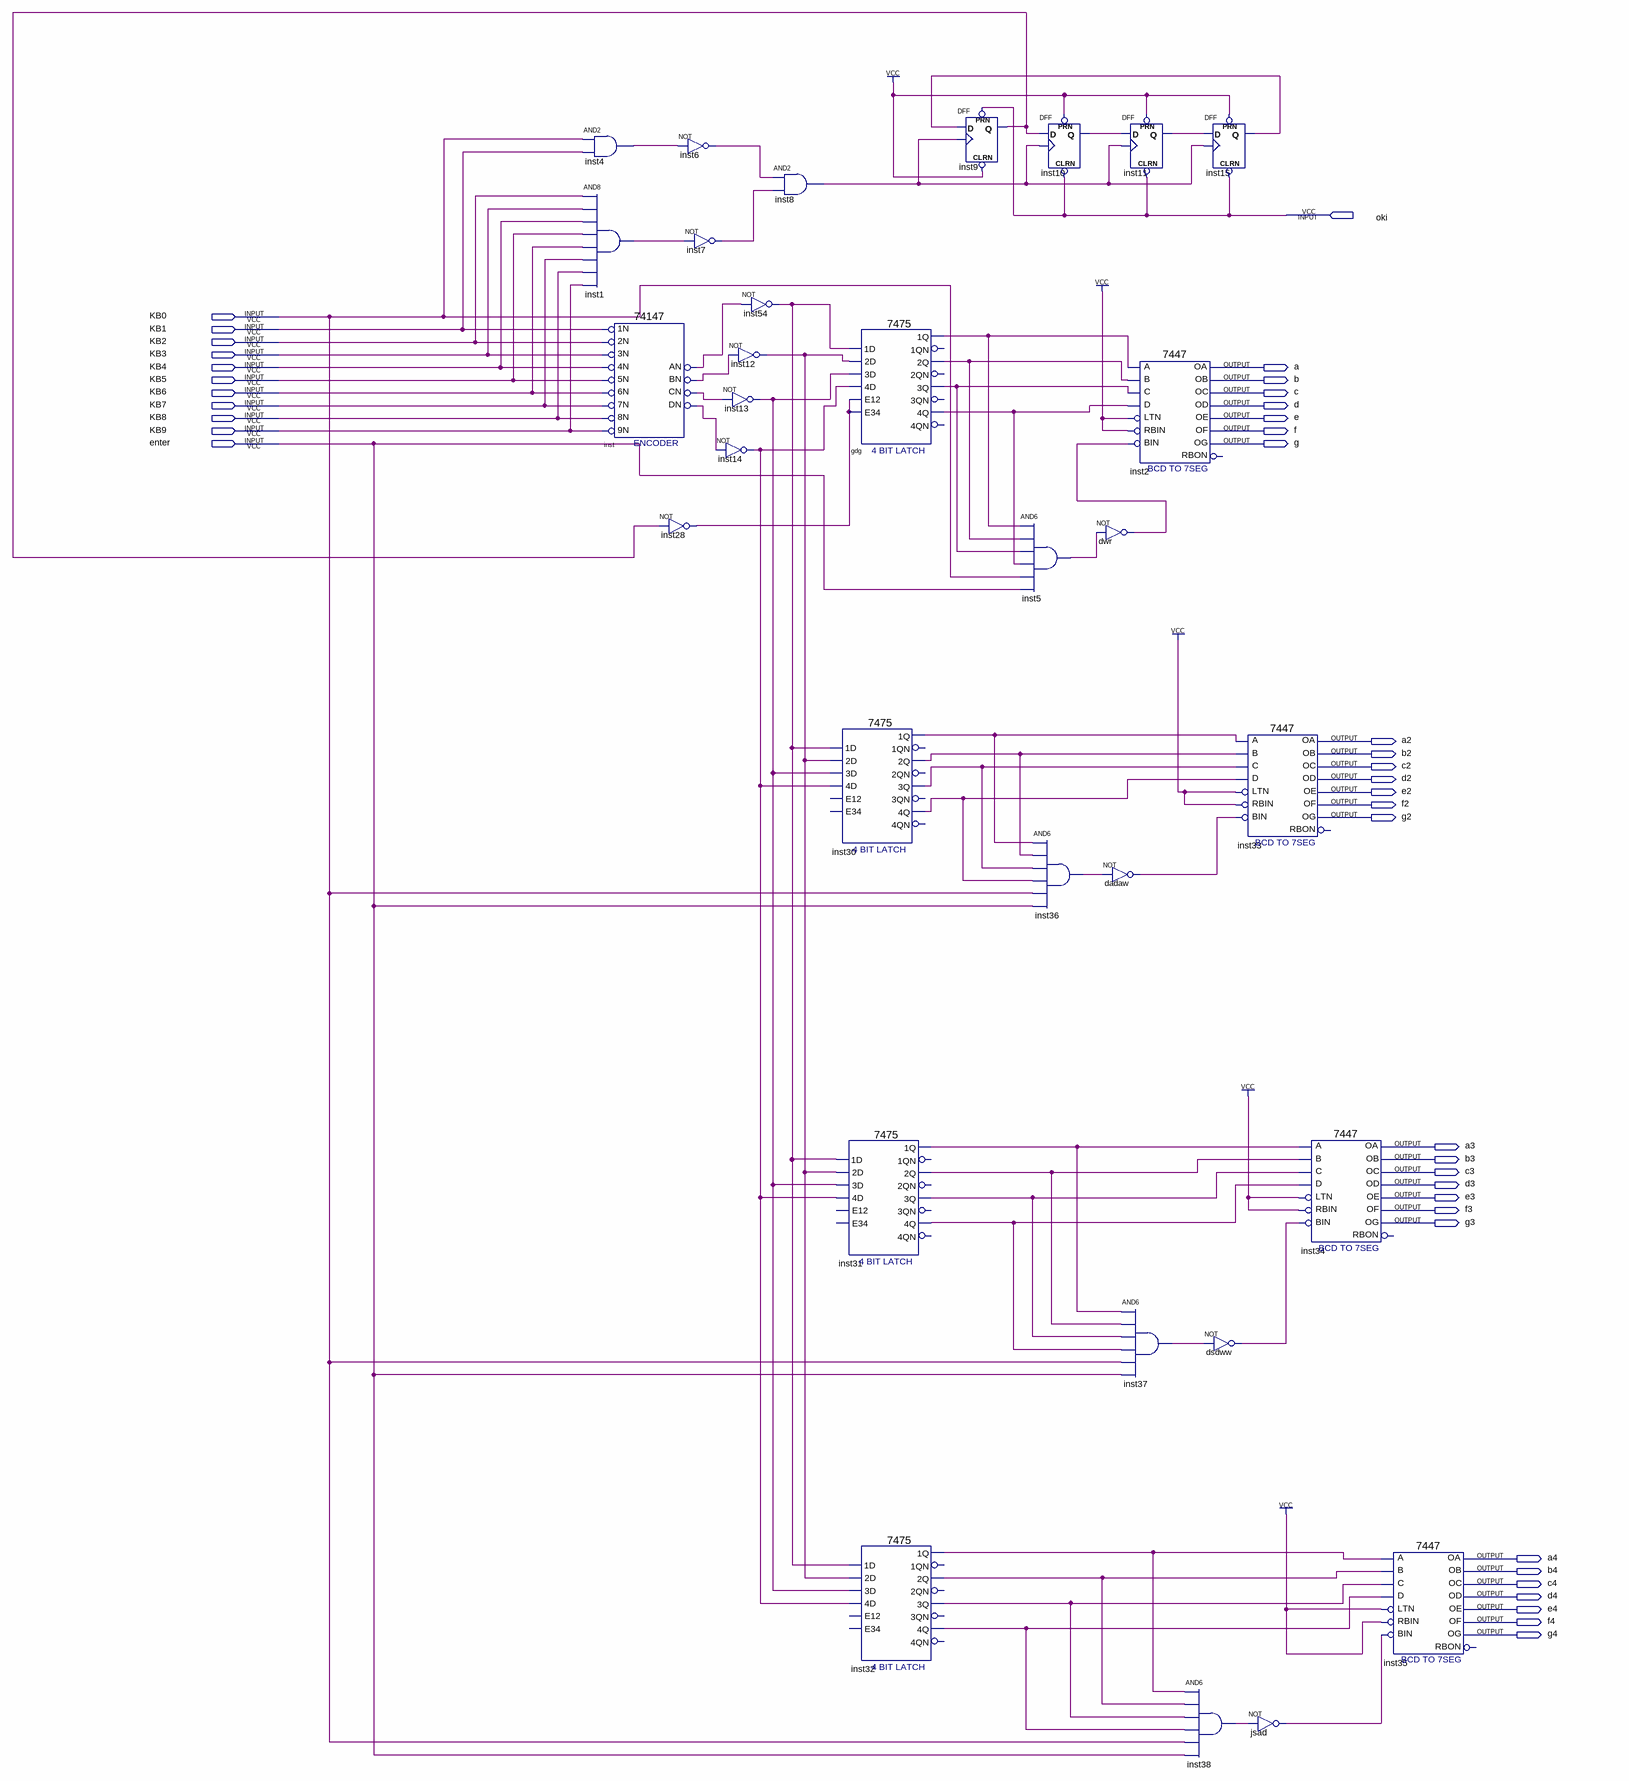
[diagram p0: schematic sheet]
// Quartus schematic SecurityBox.bdf as structural Verilog: 31 symbols, 40 pins
module SecurityBox (
  input  oki,
  input  KB0,
  input  KB1,
  input  KB2,
  input  KB3,
  input  KB4,
  input  KB5,
  input  KB6,
  input  KB7,
  input  KB8,
  input  KB9,
  input  enter,
  output a,
  output b,
  output c,
  output d,
  output e,
  output f,
  output g,
  output a2,
  output b2,
  output c2,
  output d2,
  output e2,
  output f2,
  output g2,
  output a3,
  output b3,
  output c3,
  output d3,
  output e3,
  output f3,
  output g3,
  output a4,
  output b4,
  output c4,
  output d4,
  output e4,
  output f4,
  output g4
);

  wire dadaw_out, dsdww_out, dwr_out, gdg_1q, gdg_2q, gdg_3q, gdg_4q, inst1_out, inst4_out, inst5_out,
       inst6_out, inst7_out, inst8_out, inst9_q, inst10_q, inst11_q, inst12_out, inst13_out, inst14_out,
       inst15_q, inst28_out, inst30_1q, inst30_2q, inst30_3q, inst30_4q, inst31_1q, inst31_2q, inst31_3q,
       inst31_4q, inst32_1q, inst32_2q, inst32_3q, inst32_4q, inst36_out, inst37_out, inst38_out, inst54_out,
       inst_an, inst_bn, inst_cn, inst_dn, jsad_out;

  and inst4 (inst4_out, KB0, KB1);
  and inst1 (inst1_out, KB2, KB3, KB4, KB5, KB6, KB7, KB8, KB9);
  \74147  inst (
    .\1N (KB1), .\2N (KB2), .\3N (KB3), .\6N (KB6), .\5N (KB5), .\4N (KB4), .\9N (KB9), .\8N (KB8),
    .\7N (KB7), .CN(inst_cn), .BN(inst_bn), .AN(inst_an), .DN(inst_dn));
  not inst6 (inst6_out, inst4_out);
  not inst7 (inst7_out, inst1_out);
  not inst28 (inst28_out, inst9_q);
  not inst12 (inst12_out, inst_bn);
  not inst13 (inst13_out, inst_cn);
  not inst14 (inst14_out, inst_dn);
  and inst8 (inst8_out, inst6_out, inst7_out);
  not inst54 (inst54_out, inst_an);
  \7475  inst30 (
    .\3D (inst13_out), .\4D (inst14_out), .\2D (inst12_out), .\1D (inst54_out), .\1Q (inst30_1q),
    .\2Q (inst30_2q), .\3Q (inst30_3q), .\4Q (inst30_4q));  // open: E12, E34, 1QN, 3QN, 4QN, 2QN
  \7475  inst31 (
    .\3D (inst13_out), .\4D (inst14_out), .\2D (inst12_out), .\1D (inst54_out), .\1Q (inst31_1q),
    .\2Q (inst31_2q), .\3Q (inst31_3q), .\4Q (inst31_4q));  // open: E12, E34, 1QN, 3QN, 4QN, 2QN
  \7475  gdg (
    .E12(inst28_out), .\3D (inst13_out), .\4D (inst14_out), .\2D (inst12_out), .E34(inst28_out),
    .\1D (inst54_out), .\1Q (gdg_1q), .\2Q (gdg_2q), .\3Q (gdg_3q), .\4Q (gdg_4q));  // open: 1QN, 3QN, 4QN, 2QN
  \7475  inst32 (
    .\3D (inst13_out), .\4D (inst14_out), .\2D (inst12_out), .\1D (inst54_out), .\1Q (inst32_1q),
    .\2Q (inst32_2q), .\3Q (inst32_3q), .\4Q (inst32_4q));  // open: E12, E34, 1QN, 3QN, 4QN, 2QN
  DFF inst9 (.CLRN(1'b1), .CLK(inst8_out), .D(inst15_q), .PRN(oki), .Q(inst9_q));
  DFF inst10 (.CLRN(oki), .CLK(inst8_out), .D(inst9_q), .PRN(1'b1), .Q(inst10_q));
  and inst5 (inst5_out, gdg_1q, gdg_2q, gdg_3q, gdg_4q, KB0, enter);
  and inst36 (inst36_out, inst30_1q, inst30_2q, inst30_3q, inst30_4q, KB0, enter);
  DFF inst11 (.CLRN(oki), .CLK(inst8_out), .D(inst10_q), .PRN(1'b1), .Q(inst11_q));
  \7447  inst2 (
    .LTN(1'b1), .B(gdg_2q), .C(gdg_3q), .D(gdg_4q), .RBIN(1'b1), .BIN(dwr_out), .A(gdg_1q), .OB(b), .OC(c),
    .OE(e), .OD(d), .OF(f), .OG(g), .OA(a));  // open: RBON
  not dwr (dwr_out, inst5_out);
  not dadaw (dadaw_out, inst36_out);
  and inst37 (inst37_out, inst31_1q, inst31_2q, inst31_3q, inst31_4q, KB0, enter);
  and inst38 (inst38_out, inst32_1q, inst32_2q, inst32_3q, inst32_4q, KB0, enter);
  DFF inst15 (.CLRN(oki), .CLK(inst8_out), .D(inst11_q), .PRN(1'b1), .Q(inst15_q));
  \7447  inst33 (
    .LTN(1'b1), .B(inst30_2q), .C(inst30_3q), .D(inst30_4q), .RBIN(1'b1), .BIN(dadaw_out), .A(inst30_1q),
    .OB(b2), .OC(c2), .OE(e2), .OD(d2), .OF(f2), .OG(g2), .OA(a2));  // open: RBON
  not dsdww (dsdww_out, inst37_out);
  not jsad (jsad_out, inst38_out);
  \7447  inst34 (
    .LTN(1'b1), .B(inst31_2q), .C(inst31_3q), .D(inst31_4q), .RBIN(1'b1), .BIN(dsdww_out), .A(inst31_1q),
    .OB(b3), .OC(c3), .OE(e3), .OD(d3), .OF(f3), .OG(g3), .OA(a3));  // open: RBON
  \7447  inst35 (
    .LTN(1'b1), .B(inst32_2q), .C(inst32_3q), .D(inst32_4q), .RBIN(1'b1), .BIN(jsad_out), .A(inst32_1q),
    .OB(b4), .OC(c4), .OE(e4), .OD(d4), .OF(f4), .OG(g4), .OA(a4));  // open: RBON
endmodule
